# EAGLE schematic schematic (EAGLE 5.07)

## Sheet 1 of 3
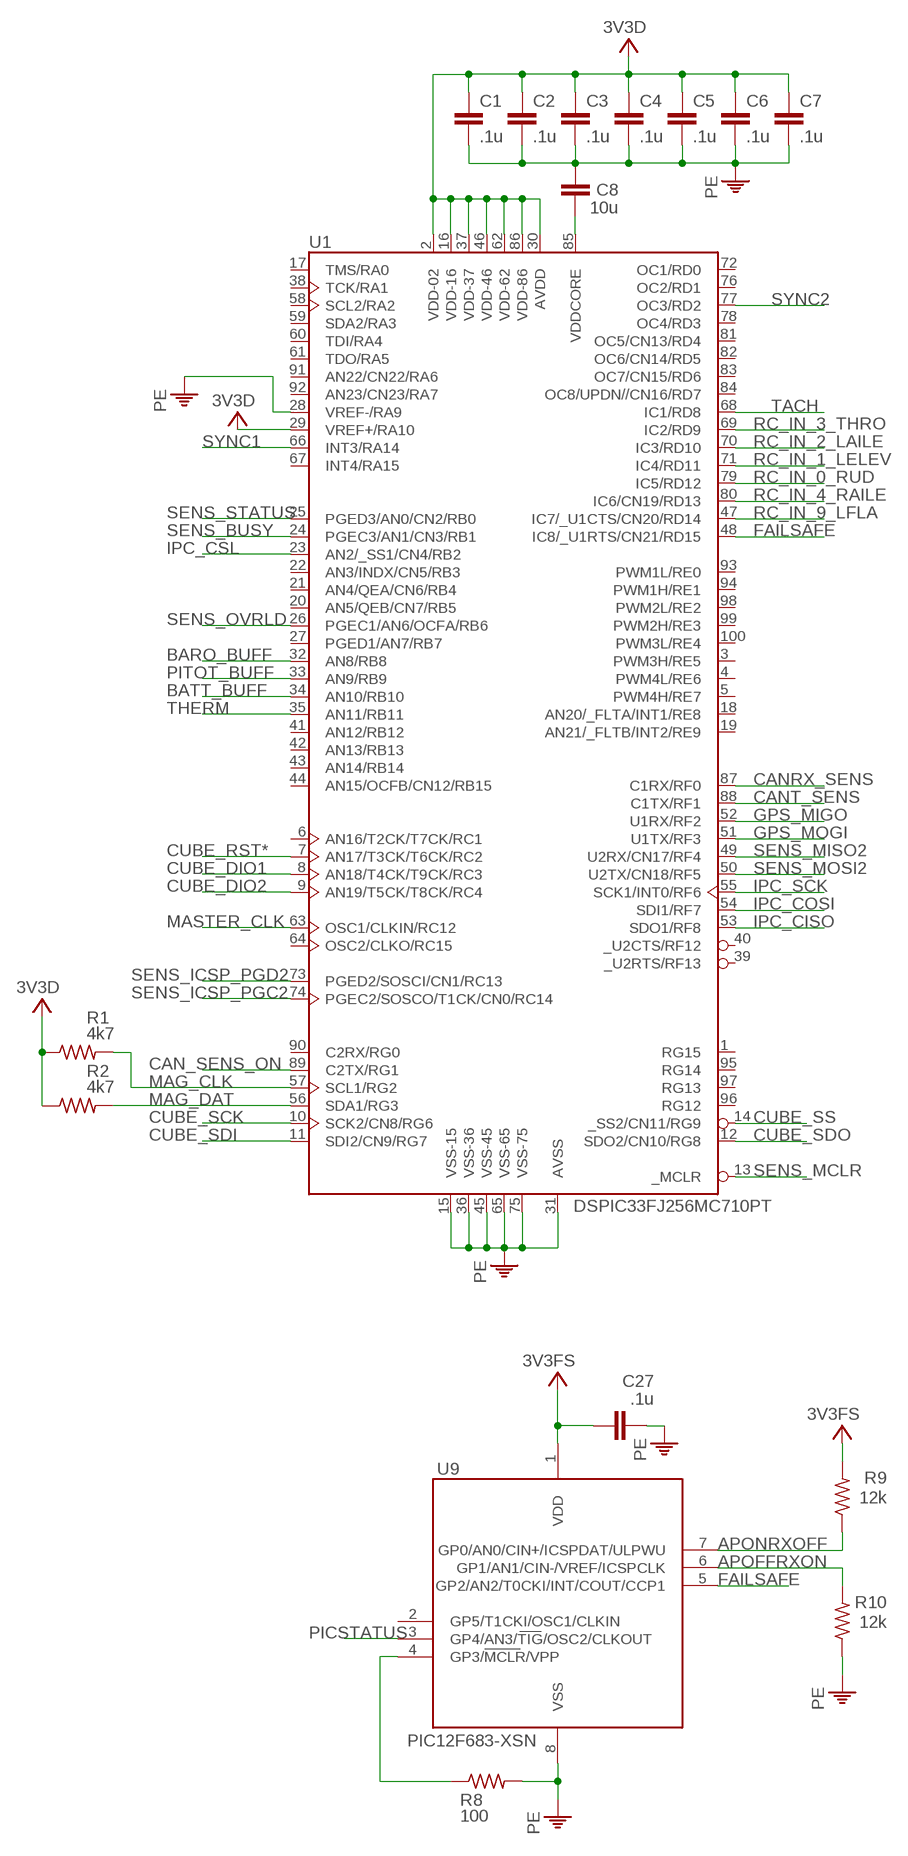
[diagram p0: schematic, sheet 1, part 1 of 2]
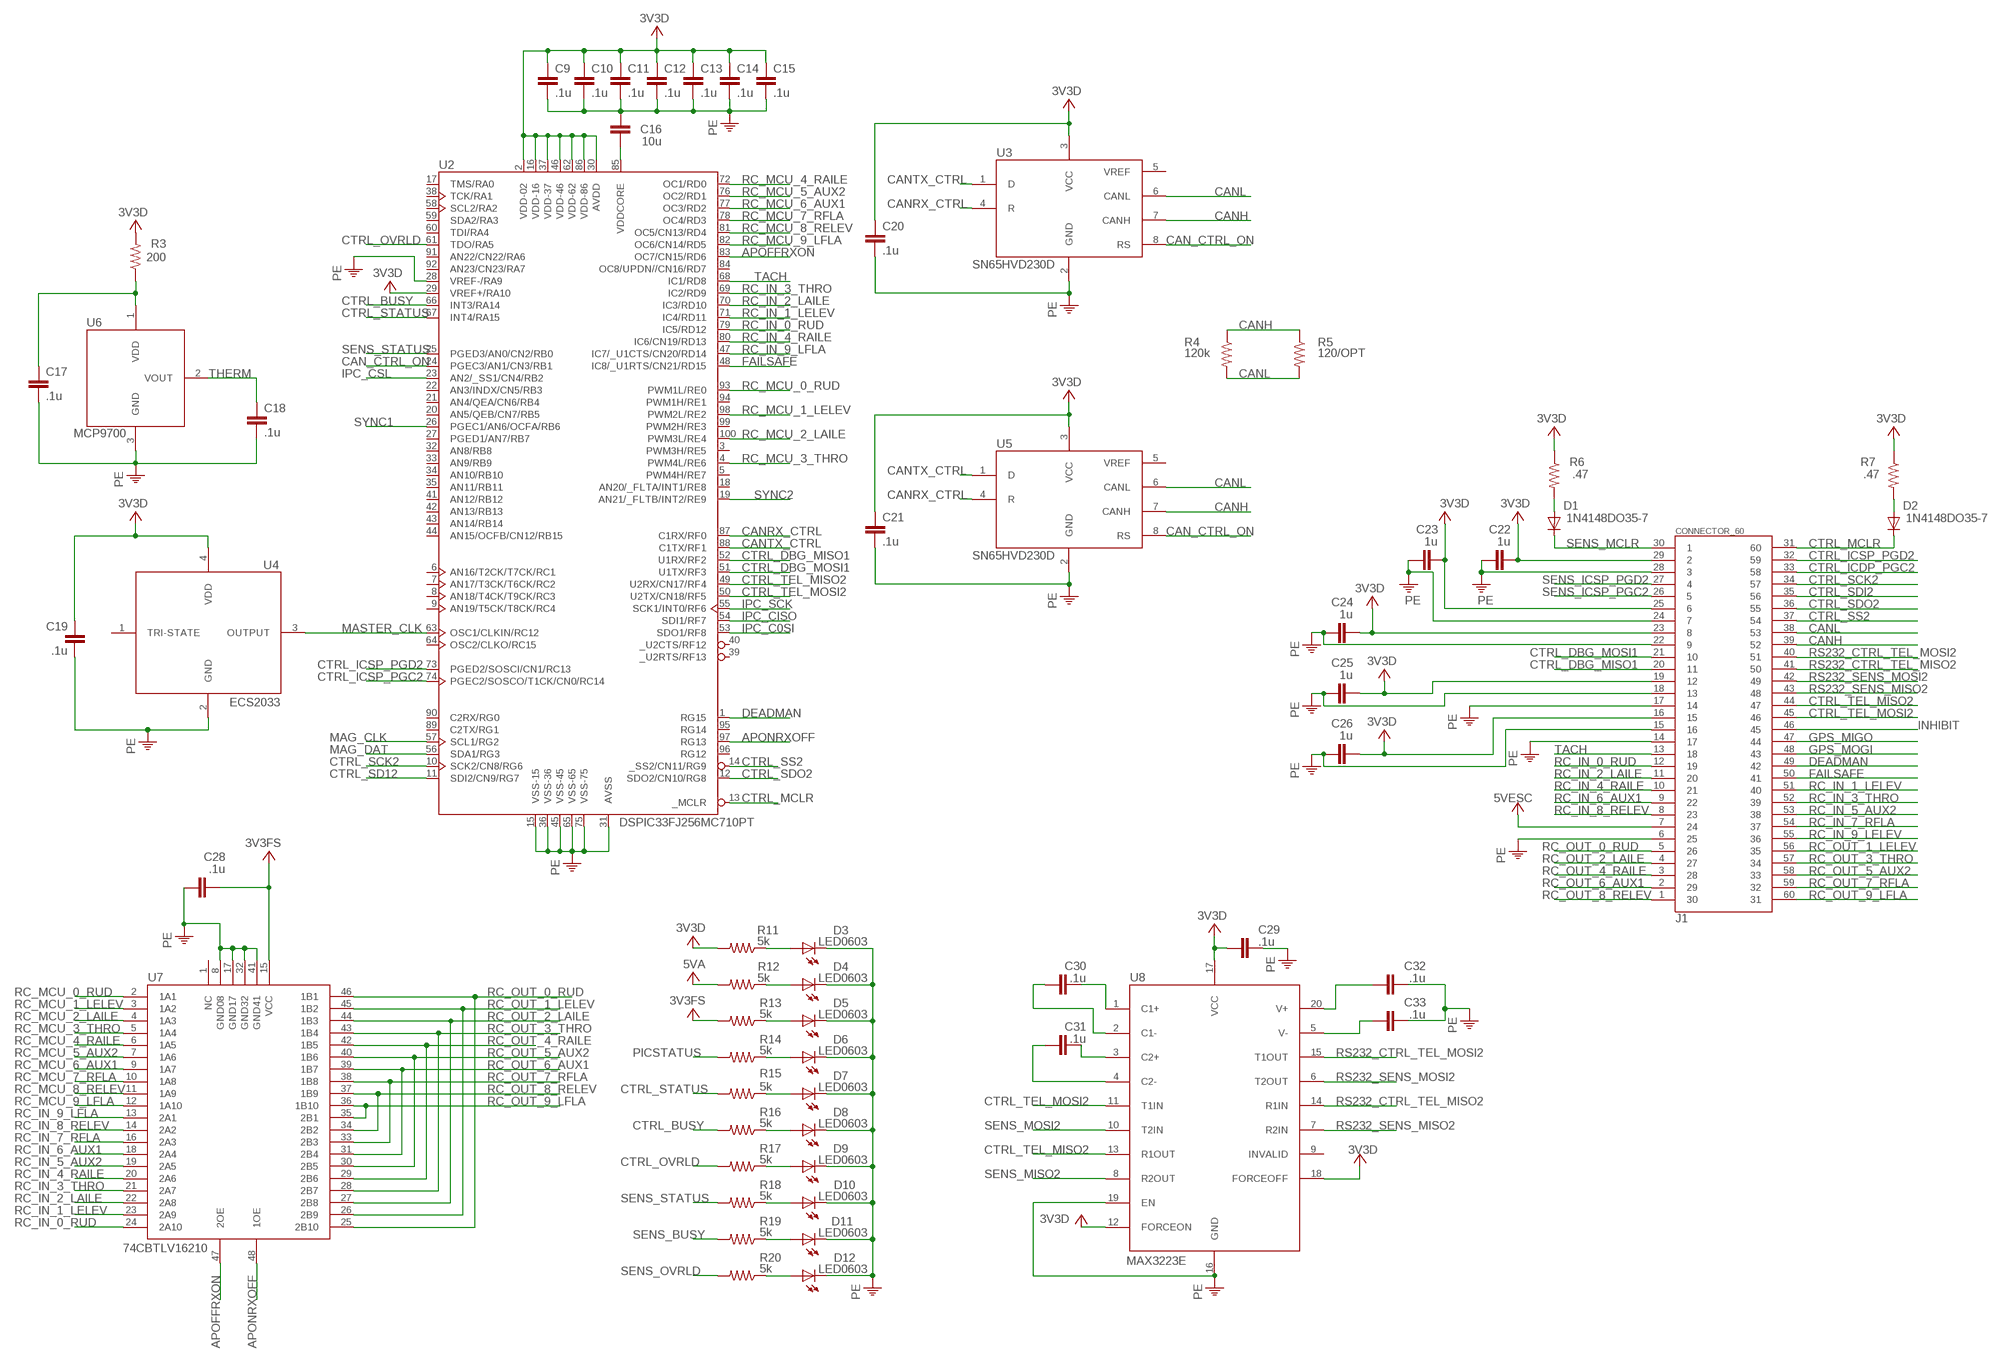
[diagram p1: schematic, sheet 1, part 2 of 2]

### Parts
C1  .1u  C-EUC0603  [C0603]
C2  .1u  C-EUC0603  [C0603]
C3  .1u  C-EUC0603  [C0603]
C4  .1u  C-EUC0603  [C0603]
C5  .1u  C-EUC0603  [C0603]
C6  .1u  C-EUC0603  [C0603]
C7  .1u  C-EUC0603  [C0603]
C8  10u  C-EUC0603  [C0603]
C9  .1u  C-EUC0603  [C0603]
C10  .1u  C-EUC0603  [C0603]
C11  .1u  C-EUC0603  [C0603]
C12  .1u  C-EUC0603  [C0603]
C13  .1u  C-EUC0603  [C0603]
C14  .1u  C-EUC0603  [C0603]
C15  .1u  C-EUC0603  [C0603]
C16  10u  C-EUC0603  [C0603]
C17  .1u  C-EUC0603  [C0603]
C18  .1u  C-EUC0603  [C0603]
C19  .1u  C-EUC0603  [C0603]
C20  .1u  C-EUC0603  [C0603]
C21  .1u  C-EUC0603  [C0603]
C22  1u  C-EUC0603  [C0603]
C23  1u  C-EUC0603  [C0603]
C24  1u  C-EUC0603  [C0603]
C25  1u  C-EUC0603  [C0603]
C26  1u  C-EUC0603  [C0603]
C27  .1u  C-EUC0603  [C0603]
C28  .1u  C-EUC0603  [C0603]
C29  .1u  C-EUC0603  [C0603]
C30  .1u  C-EUC0603  [C0603]
C31  .1u  C-EUC0603  [C0603]
C32  .1u  C-EUC0603  [C0603]
C33  .1u  C-EUC0603  [C0603]
D1  1N4148DO35-7  [DO35-7]
D2  1N4148DO35-7  [DO35-7]
D3  LED0603  LEDCHIP-LED0603  [CHIP-LED0603]
D4  LED0603  LEDCHIP-LED0603  [CHIP-LED0603]
D5  LED0603  LEDCHIP-LED0603  [CHIP-LED0603]
D6  LED0603  LEDCHIP-LED0603  [CHIP-LED0603]
D7  LED0603  LEDCHIP-LED0603  [CHIP-LED0603]
D8  LED0603  LEDCHIP-LED0603  [CHIP-LED0603]
D9  LED0603  LEDCHIP-LED0603  [CHIP-LED0603]
D10  LED0603  LEDCHIP-LED0603  [CHIP-LED0603]
D11  LED0603  LEDCHIP-LED0603  [CHIP-LED0603]
D12  LED0603  LEDCHIP-LED0603  [CHIP-LED0603]
J1  CONNECTOR_60  PRUEBA  [CONECTOR_60_TYCO_MODIFICADO]
R1  4k7  R-US_R0603  [R0603]
R2  4k7  R-US_R0603  [R0603]
R3  200  R-US_R0603  [R0603]
R4  120k  R-US_R0603  [R0603]
R5  120/OPT  R-US_R0603  [R0603]
R6  .47  R-US_R0603  [R0603]
R7  .47  R-US_R0603  [R0603]
R8  100  R-US_R0603  [R0603]
R9  12k  R-US_R0603  [R0603]
R10  12k  R-US_R0603  [R0603]
R11  5k  R-US_R0603  [R0603]
R12  5k  R-US_R0603  [R0603]
R13  5k  R-US_R0603  [R0603]
R14  5k  R-US_R0603  [R0603]
R15  5k  R-US_R0603  [R0603]
R16  5k  R-US_R0603  [R0603]
R17  5k  R-US_R0603  [R0603]
R18  5k  R-US_R0603  [R0603]
R19  5k  R-US_R0603  [R0603]
R20  5k  R-US_R0603  [R0603]
U1  DSPIC33FJ256MC710PT  [DSPIC33FJ256MC710PT]
U2  DSPIC33FJ256MC710PT  [DSPIC33FJ256MC710PT]
U3  CAN  [CAN]
U4  ECS2033  [ECS2003]
U5  CAN  [CAN]
U6  MCP9700_PATRON_RECOMENDADO  [MCP9700_PATRON_RECOMENDADO]
U7  74CBTLV16210  [74CBTLV16210]
U8  MAX3223E  [MAX3223E]
U9  PIC12F683  [PIC12F683]

### Nets
+3V3: C1.1 C7.1 C9.1 C15.1 C19.2 C20.1 C21.1 C22.2 C23.2 C24.2 C25.2 C26.2 C27.1 C28.2 C29.2 J1.16 J1.19 J1.23 J1.25 J1.29 R1.1 R2.1 R3.2 R6.1 R7.1 R9.2 R11.2 R13.2 U1.2(VDD-02) U1.16(VDD-16) U1.29(VREF+/RA10) U1.30(AVDD) U1.37(VDD-37) U1.46(VDD-46) U1.62(VDD-62) U1.86(VDD-86) U2.2(VDD-02) U2.16(VDD-16) U2.29(VREF+/RA10) U2.30(AVDD) U2.37(VDD-37) U2.46(VDD-46) U2.62(VDD-62) U2.86(VDD-86) U3.3(VCC) U4.4(VDD) U5.3(VCC) U7.15(VCC) U8.12(FORCEON) U8.17(VCC) U8.18(FORCEOFF) U9.1(VDD) ; supply symbol labelled 3V3D, 3V3FS ; also sheet 2,3
+5V: J1.7 R12.2 ; supply symbol labelled 5VA, 5VESC ; also sheet 2,3
APOFFRXON: R10.2 U2.83(OC7/CN15/RD6) U7.47(2OE) U9.6(GP1/AN1/CIN-/VREF/ICSPCLK)
APONRXOFF: R9.1 U2.97(RG13) U7.48(1OE) U9.7(GP0/AN0/CIN+/ICSPDAT/ULPWU)
BARO_BUFF: U1.32(AN8/RB8) ; also sheet 3
BATT_BUFF: U1.34(AN10/RB10) ; also sheet 3
CAN_CTRL_ON: U2.24(PGEC3/AN1/CN3/RB1) U3.8(RS) U5.8(RS)
CAN_SENS_ON: U1.89(C2TX/RG1)
CANH: J1.39 R4.1 R5.1 U3.7(CANH) U5.7(CANH)
CANL: J1.38 R4.2 R5.2 U3.6(CANL) U5.6(CANL)
CANRX_CTRL: U2.87(C1RX/RF0) U3.4(R) U5.4(R)
CANRX_SENS: U1.87(C1RX/RF0)
CANT_SENS: U1.88(C1TX/RF1)
CANTX_CTRL: U2.88(C1TX/RF1) U3.1(D) U5.1(D)
CTRL_BUSY: R16.2 U2.66(INT3/RA14)
CTRL_DBG_MISO1: J1.20 U2.52(U1RX/RF2)
CTRL_DBG_MOSI1: J1.21 U2.51(U1TX/RF3)
CTRL_ICDP_PGC2: J1.33
CTRL_ICSP_PGC2: U2.74(PGEC2/SOSCO/T1CK/CN0/RC14)
CTRL_ICSP_PGD2: J1.32 U2.73(PGED2/SOSCI/CN1/RC13)
CTRL_MCLR: D2.C J1.31 U2.13(_MCLR)
CTRL_OVRLD: R17.2 U2.61(TDO/RA5)
CTRL_SCK2: J1.34 U2.10(SCK2/CN8/RG6)
CTRL_SD12: U2.11(SDI2/CN9/RG7)
CTRL_SDI2: J1.35
CTRL_SDO2: J1.36 U2.12(SDO2/CN10/RG8)
CTRL_SS2: J1.37 U2.14(_SS2/CN11/RG9)
CTRL_STATUS: R15.2 U2.67(INT4/RA15)
CTRL_TEL_MISO2: J1.44 U2.49(U2RX/CN17/RF4) U8.13(R1OUT)
CTRL_TEL_MOSI2: J1.45 U2.50(U2TX/CN18/RF5) U8.11(T1IN)
CUBE_DIO1: U1.8(AN18/T4CK/T9CK/RC3) ; also sheet 3
CUBE_DIO2: U1.9(AN19/T5CK/T8CK/RC4) ; also sheet 3
CUBE_RST*: U1.7(AN17/T3CK/T6CK/RC2) ; also sheet 3
CUBE_SCK: U1.10(SCK2/CN8/RG6) ; also sheet 3
CUBE_SDI: U1.11(SDI2/CN9/RG7) ; also sheet 3
CUBE_SDO: U1.12(SDO2/CN10/RG8)
CUBE_SS: U1.14(_SS2/CN11/RG9) ; also sheet 3
DEADMAN: J1.49 U2.1(RG15)
FAILSAFE: J1.50 U1.48(IC8/_U1RTS/CN21/RD15) U2.48(IC8/_U1RTS/CN21/RD15) U9.5(GP2/AN2/T0CKI/INT/COUT/CCP1)
GPS_MIGO: J1.47 U1.52(U1RX/RF2)
GPS_MOGI: J1.48 U1.51(U1TX/RF3)
INHIBIT: J1.46 ; also sheet 2
IPC_C0SI: U2.53(SDO1/RF8)
IPC_CISO: U1.53(SDO1/RF8) U2.54(SDI1/RF7)
IPC_COSI: U1.54(SDI1/RF7)
IPC_CSL: U1.23(AN2/_SS1/CN4/RB2) U2.23(AN2/_SS1/CN4/RB2)
IPC_SCK: U1.55(SCK1/INT0/RF6) U2.55(SCK1/INT0/RF6)
MAG_CLK: R1.2 U1.57(SCL1/RG2) U2.57(SCL1/RG2) ; also sheet 3
MAG_DAT: R2.2 U1.56(SDA1/RG3) U2.56(SDA1/RG3) ; also sheet 3
MASTER_CLK: U1.63(OSC1/CLKIN/RC12) U2.63(OSC1/CLKIN/RC12) U4.3(OUTPUT)
N$6: U1.65(VSS-65)
N$13: U2.65(VSS-65)
N$32: C30.2 U8.1(C1+)
N$33: C5.1
N$34: D3.A R11.1
N$67: C8.1 U1.85(VDDCORE)
N$70: D4.A R12.1
N$103: U7.29(2B6)
N$104: D5.A R13.1
N$106: D6.A R14.1
N$107: D7.A R15.1
N$108: D8.A R16.1
N$109: D9.A R17.1
N$110: C10.1 C11.1 C12.1 C14.1
N$111: D10.A R18.1
N$112: D11.A R19.1
N$113: D12.A R20.1
N$114: C30.1 U8.2(C1-)
N$115: C32.1 U8.20(V+)
N$116: C31.2 U8.3(C2+)
N$117: C31.1 U8.4(C2-)
N$118: C33.1 U8.5(V-)
N$120: D1.A R6.2
N$135: D2.A R7.2
N$143: C13.1
N$146: C16.1 U2.85(VDDCORE)
N$161: R8.1 U9.4(GP3/MCLR/VPP)
N$170: C17.1 R3.1 U6.1(VDD)
N$187: C2.1 C3.1 C4.1 C6.1
PE: C1.2 C2.2 C3.2 C4.2 C5.2 C6.2 C7.2 C8.2 C9.2 C10.2 C11.2 C12.2 C13.2 C14.2 C15.2 C16.2 C17.2 C18.2 C19.1 C20.2 C21.2 C22.1 C23.1 C24.1 C25.1 C26.1 C27.2 C28.1 C29.1 C32.2 C33.2 D3.C D4.C D5.C D6.C D7.C D8.C D9.C D10.C D11.C D12.C J1.6 J1.14 J1.15 J1.17 J1.18 J1.22 J1.24 J1.28 R8.2 R10.1 U1.15(VSS-15) U1.28(VREF-/RA9) U1.31(AVSS) U1.36(VSS-36) U1.45(VSS-45) U1.75(VSS-75) U2.15(VSS-15) U2.28(VREF-/RA9) U2.31(AVSS) U2.36(VSS-36) U2.45(VSS-45) U2.75(VSS-75) U3.2(GND) U4.2(GND) U5.2(GND) U6.3(GND) U7.8(GND08) U7.17(GND17) U7.32(GND32) U7.41(GND41) U8.16(GND) U8.19(EN) U9.8(VSS) ; also sheet 2,3
PICSTATUS: R14.2 U9.3(GP4/AN3/TIG/OSC2/CLKOUT)
PITOT_BUFF: U1.33(AN9/RB9) ; also sheet 3
RC_IN_0_RUD: J1.12 U1.79(IC5/RD12) U2.79(IC5/RD12) U7.24(2A10)
RC_IN_1_LELEV: J1.51 U1.71(IC4/RD11) U2.71(IC4/RD11) U7.23(2A9)
RC_IN_2_LAILE: J1.11 U1.70(IC3/RD10) U2.70(IC3/RD10) U7.22(2A8)
RC_IN_3_THRO: J1.52 U1.69(IC2/RD9) U2.69(IC2/RD9) U7.21(2A7)
RC_IN_4_RAILE: J1.10 U1.80(IC6/CN19/RD13) U2.80(IC6/CN19/RD13) U7.20(2A6)
RC_IN_5_AUX2: J1.53 U7.19(2A5)
RC_IN_6_AUX1: J1.9 U7.18(2A4)
RC_IN_7_RFLA: J1.54 U7.16(2A3)
RC_IN_8_RELEV: J1.8 U7.14(2A2)
RC_IN_9_LELEV: J1.55
RC_IN_9_LFLA: U1.47(IC7/_U1CTS/CN20/RD14) U2.47(IC7/_U1CTS/CN20/RD14) U7.13(2A1)
RC_MCU_0_RUD: U2.93(PWM1L/RE0) U7.2(1A1)
RC_MCU_1_LELEV: U2.98(PWM2L/RE2) U7.3(1A2)
RC_MCU_2_LAILE: U2.100(PWM3L/RE4) U7.4(1A3)
RC_MCU_3_THRO: U2.4(PWM4L/RE6) U7.5(1A4)
RC_MCU_4_RAILE: U2.72(OC1/RD0) U7.6(1A5)
RC_MCU_5_AUX2: U2.76(OC2/RD1) U7.7(1A6)
RC_MCU_6_AUX1: U2.77(OC3/RD2) U7.9(1A7)
RC_MCU_7_RFLA: U2.78(OC4/RD3) U7.10(1A8)
RC_MCU_8_RELEV: U2.81(OC5/CN13/RD4) U7.11(1A9)
RC_MCU_9_LFLA: U2.82(OC6/CN14/RD5) U7.12(1A10)
RC_OUT_0_RUD: J1.5 U7.25(2B10) U7.46(1B1)
RC_OUT_1_LELEV: J1.56 U7.26(2B9) U7.45(1B2)
RC_OUT_2_LAILE: J1.4 U7.27(2B8) U7.44(1B3)
RC_OUT_3_THRO: J1.57 U7.28(2B7) U7.43(1B4)
RC_OUT_4_RAILE: J1.3 U7.42(1B5)
RC_OUT_5_AUX2: J1.58 U7.30(2B5) U7.40(1B6)
RC_OUT_6_AUX1: J1.2 U7.31(2B4) U7.39(1B7)
RC_OUT_7_RFLA: J1.59 U7.33(2B3) U7.38(1B8)
RC_OUT_8_RELEV: J1.1 U7.34(2B2) U7.37(1B9)
RC_OUT_9_LFLA: J1.60 U7.35(2B1) U7.36(1B10)
RS232_CTRL_TEL_MISO2: J1.41 U8.14(R1IN)
RS232_CTRL_TEL_MOSI2: J1.40 U8.15(T1OUT)
RS232_SENS_MISO2: J1.43 U8.7(R2IN)
RS232_SENS_MOSI2: J1.42 U8.6(T2OUT)
SENS_BUSY: R19.2 U1.24(PGEC3/AN1/CN3/RB1)
SENS_ICSP_PGC2: J1.26 U1.74(PGEC2/SOSCO/T1CK/CN0/RC14)
SENS_ICSP_PGD2: J1.27 U1.73(PGED2/SOSCI/CN1/RC13)
SENS_MCLR: D1.C J1.30 U1.13(_MCLR)
SENS_MISO2: U1.49(U2RX/CN17/RF4) U8.8(R2OUT)
SENS_MOSI2: U1.50(U2TX/CN18/RF5) U8.10(T2IN)
SENS_OVRLD: R20.2 U1.26(PGEC1/AN6/OCFA/RB6)
SENS_STATUS: R18.2 U1.25(PGED3/AN0/CN2/RB0) U2.25(PGED3/AN0/CN2/RB0)
SYNC1: U1.66(INT3/RA14) U2.26(PGEC1/AN6/OCFA/RB6)
SYNC2: U1.77(OC3/RD2) U2.19(AN21/_FLTB/INT2/RE9)
TACH: J1.13 U1.68(IC1/RD8) U2.68(IC1/RD8)
THERM: C18.1 U1.35(AN11/RB11) U6.2(VOUT)
Unconnected: U1.1(RG15) U1.3(PWM3H/RE5) U1.4(PWM4L/RE6) U1.5(PWM4H/RE7) U1.6(AN16/T2CK/T7CK/RC1) U1.17(TMS/RA0) U1.18(AN20/_FLTA/INT1/RE8) U1.19(AN21/_FLTB/INT2/RE9) U1.20(AN5/QEB/CN7/RB5) U1.21(AN4/QEA/CN6/RB4) U1.22(AN3/INDX/CN5/RB3) U1.27(PGED1/AN7/RB7) U1.38(TCK/RA1) U1.39(_U2RTS/RF13) U1.40(_U2CTS/RF12) U1.41(AN12/RB12) U1.42(AN13/RB13) U1.43(AN14/RB14) U1.44(AN15/OCFB/CN12/RB15) U1.58(SCL2/RA2) U1.59(SDA2/RA3) U1.60(TDI/RA4) U1.61(TDO/RA5) U1.64(OSC2/CLKO/RC15) U1.67(INT4/RA15) U1.72(OC1/RD0) U1.76(OC2/RD1) U1.78(OC4/RD3) U1.81(OC5/CN13/RD4) U1.82(OC6/CN14/RD5) U1.83(OC7/CN15/RD6) U1.84(OC8/UPDN//CN16/RD7) U1.90(C2RX/RG0) U1.91(AN22/CN22/RA6) U1.92(AN23/CN23/RA7) U1.93(PWM1L/RE0) U1.94(PWM1H/RE1) U1.95(RG14) U1.96(RG12) U1.97(RG13) U1.98(PWM2L/RE2) U1.99(PWM2H/RE3) U1.100(PWM3L/RE4) U2.3(PWM3H/RE5) U2.5(PWM4H/RE7) U2.6(AN16/T2CK/T7CK/RC1) U2.7(AN17/T3CK/T6CK/RC2) U2.8(AN18/T4CK/T9CK/RC3) U2.9(AN19/T5CK/T8CK/RC4) U2.17(TMS/RA0) U2.18(AN20/_FLTA/INT1/RE8) U2.20(AN5/QEB/CN7/RB5) U2.21(AN4/QEA/CN6/RB4) U2.22(AN3/INDX/CN5/RB3) U2.27(PGED1/AN7/RB7) U2.32(AN8/RB8) U2.33(AN9/RB9) U2.34(AN10/RB10) U2.35(AN11/RB11) U2.38(TCK/RA1) U2.39(_U2RTS/RF13) U2.40(_U2CTS/RF12) U2.41(AN12/RB12) U2.42(AN13/RB13) U2.43(AN14/RB14) U2.44(AN15/OCFB/CN12/RB15) U2.58(SCL2/RA2) U2.59(SDA2/RA3) U2.60(TDI/RA4) U2.64(OSC2/CLKO/RC15) U2.84(OC8/UPDN//CN16/RD7) U2.89(C2TX/RG1) U2.90(C2RX/RG0) U2.91(AN22/CN22/RA6) U2.92(AN23/CN23/RA7) U2.94(PWM1H/RE1) U2.95(RG14) U2.96(RG12) U2.99(PWM2H/RE3) U3.5(VREF) U4.1(TRI-STATE) U5.5(VREF) U7.1(NC) U8.9(INVALID) U9.2(GP5/T1CKI/OSC1/CLKIN)

## Sheet 2 of 3
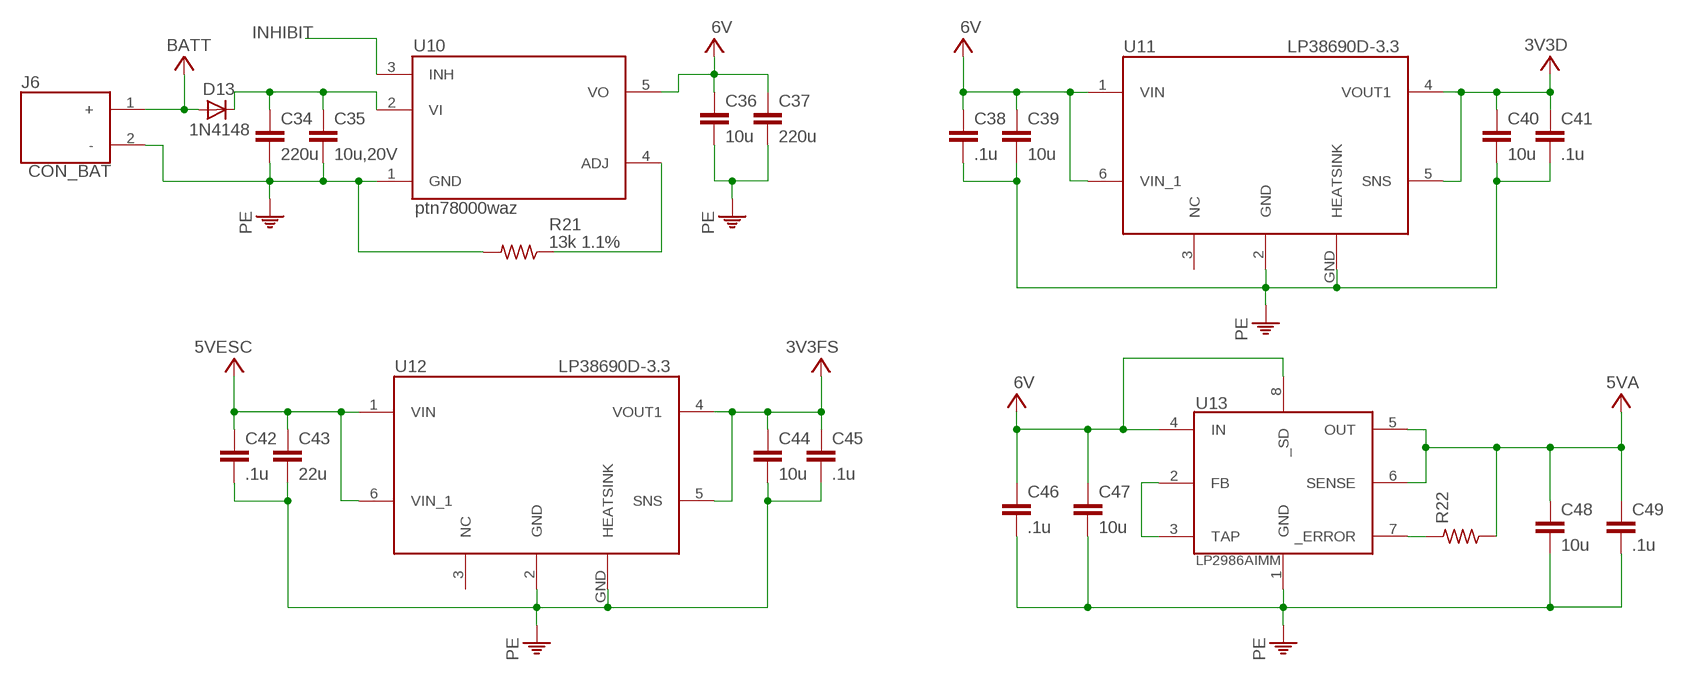
[diagram p2: schematic, sheet 2]

### Parts
C34  220u  C-EUC0603  [C0603]
C35  10u,20V  C-EUC0603  [C0603]
C36  10u  C-EUC0603  [C0603]
C37  220u  C-EUC0603  [C0603]
C38  .1u  C-EUC0603  [C0603]
C39  10u  C-EUC0603  [C0603]
C40  10u  C-EUC0603  [C0603]
C41  .1u  C-EUC0603  [C0603]
C42  .1u  C-EUC0603  [C0603]
C43  22u  C-EUC0603  [C0603]
C44  10u  C-EUC0603  [C0603]
C45  .1u  C-EUC0603  [C0603]
C46  .1u  C-EUC0603  [C0603]
C47  10u  C-EUC0603  [C0603]
C48  10u  C-EUC0603  [C0603]
C49  .1u  C-EUC0603  [C0603]
D13  1N4148  1N4148DO35-7  [DO35-7]
J6  CON_BAT  [CON_BAT]
R21  13k 1.1%  R-US_R0603  [R0603]
R22  R-US_R0603  [R0603]
U10  PTN78000W  [PTN78000W]
U11  LP38690SD-3.3  [LP38690SD-3.3]
U12  LP38690SD-3.3  [LP38690SD-3.3]
U13  LP2986AIMM-1  [M08A]

### Nets
+3V3: C40.1 C41.1 C44.1 C45.1 D13.A J6.1(+) U11.4(VOUT1) U11.5(SNS) U12.4(VOUT1) U12.5(SNS) ; supply symbol labelled BATT, 3V3D, 3V3FS ; also sheet 1,3
+5V: C36.1 C37.1 C38.1 C39.1 C42.1 C43.1 C46.1 C47.1 C48.1 C49.1 R22.1 U10.5(VO) U11.1(VIN) U11.6(VIN_1) U12.1(VIN) U12.6(VIN_1) U13.4(IN) U13.5(OUT) U13.6(SENSE) U13.8(_SD) ; supply symbol labelled 6V, 5VESC, 5VA ; also sheet 1,3
INHIBIT: U10.3(INH) ; also sheet 1
N$1: R21.1 U10.4(ADJ)
N$11: C34.1 C35.1 D13.C U10.2(VI)
N$12: U13.2(FB) U13.3(TAP)
N$16: R22.2 U13.7(_ERROR)
PE: C34.2 C35.2 C36.2 C37.2 C38.2 C39.2 C40.2 C41.2 C42.2 C43.2 C44.2 C45.2 C46.2 C47.2 C48.2 C49.2 J6.2(-) R21.2 U10.1(GND) U11.2(GND) U11.GND(HEATSINK) U12.2(GND) U12.GND(HEATSINK) U13.1(GND) ; also sheet 1,3
Unconnected: U11.3(NC) U12.3(NC)

## Sheet 3 of 3
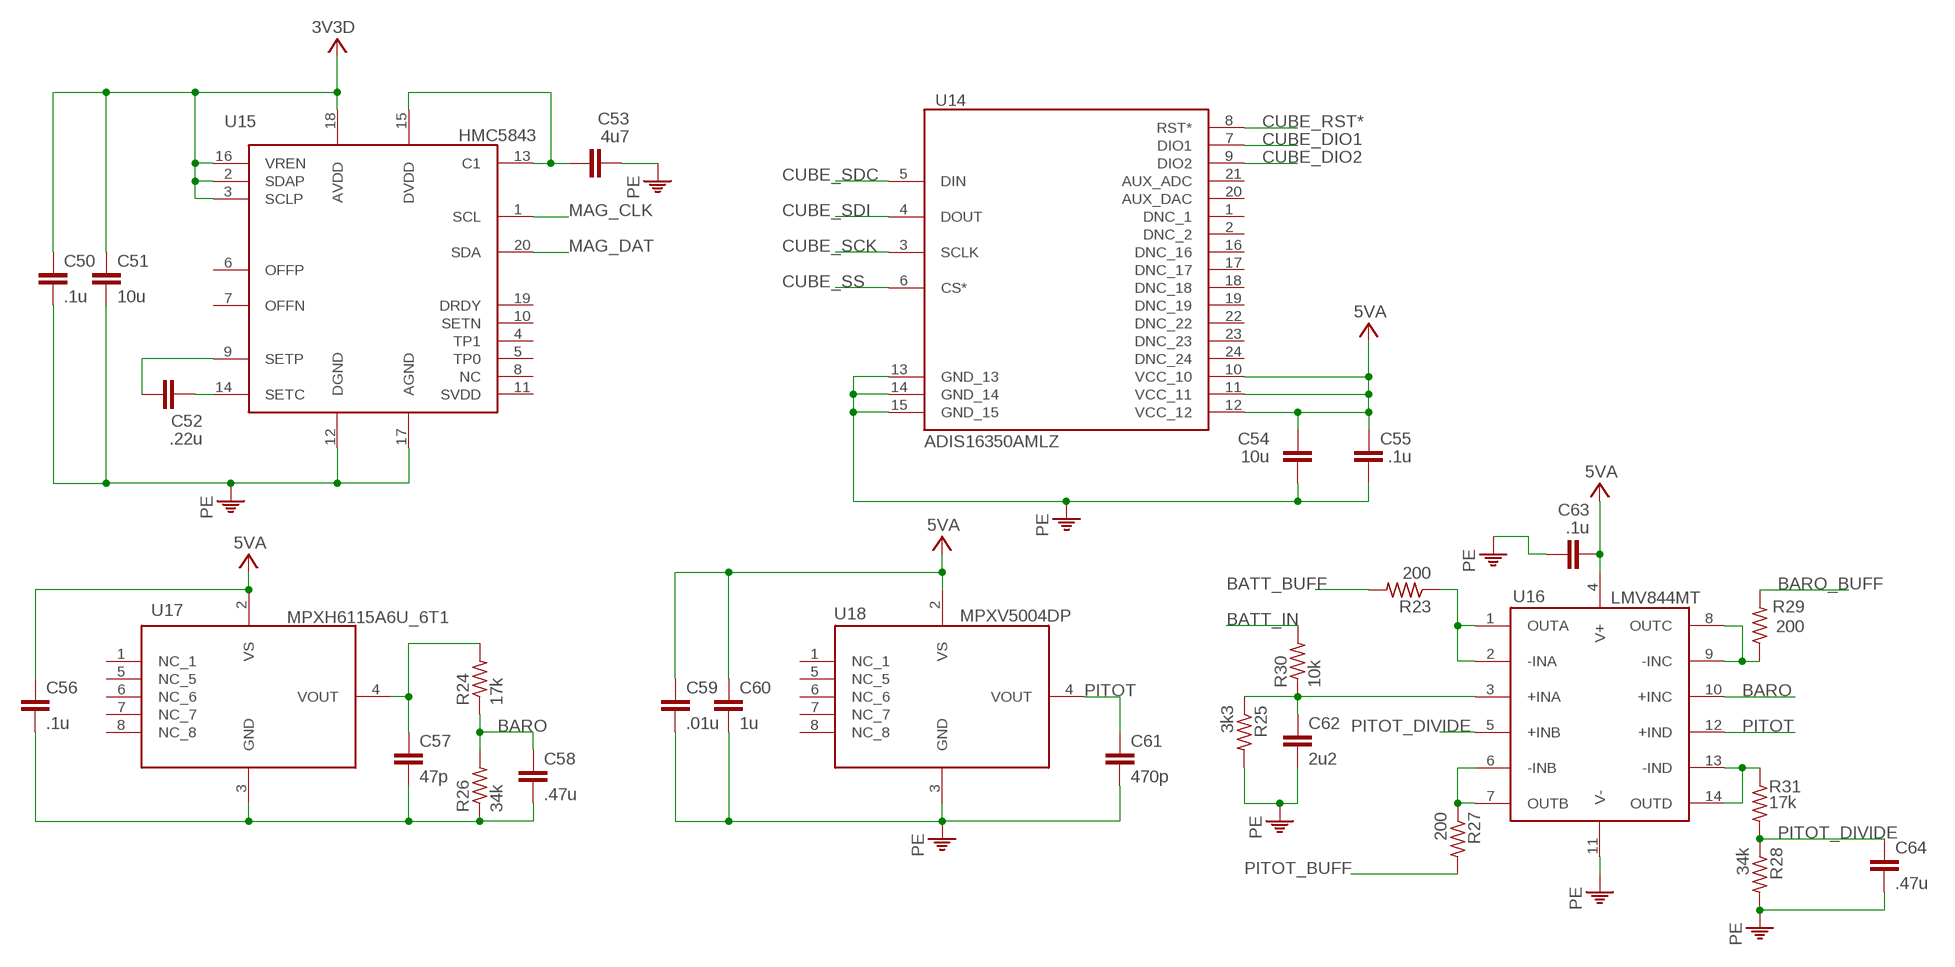
[diagram p3: schematic, sheet 3]

### Parts
C50  .1u  C-EUC0603  [C0603]
C51  10u  C-EUC0603  [C0603]
C52  .22u  C-EUC0603  [C0603]
C53  4u7  C-EUC0603  [C0603]
C54  10u  C-EUC0603  [C0603]
C55  .1u  C-EUC0603  [C0603]
C56  .1u  C-EUC0603  [C0603]
C57  47p  C-EUC0603  [C0603]
C58  .47u  C-EUC0603  [C0603]
C59  .01u  C-EUC0603  [C0603]
C60  1u  C-EUC0603  [C0603]
C61  470p  C-EUC0603  [C0603]
C62  2u2  C-EUC0603  [C0603]
C63  .1u  C-EUC0603  [C0603]
C64  .47u  C-EUC0603  [C0603]
R23  200  R-US_R0603  [R0603]
R24  17k  R-US_R0603  [R0603]
R25  3k3  R-US_R0603  [R0603]
R26  34k  R-US_R0603  [R0603]
R27  200  R-US_R0603  [R0603]
R28  34k  R-US_R0603  [R0603]
R29  200  R-US_R0603  [R0603]
R30  10k  R-US_R0603  [R0603]
R31  17k  R-US_R0603  [R0603]
U14  ADIS16355AMLZ  [ADIS16355AMLZ]
U15  HMC5843  [HMC5843]
U16  LMV844MT  [MTC14]
U17  MPXH6115A6U_6T1  [1317A-03]
U18  MPXV5004DP  [1351-01]

### Nets
+3V3: C50.1 C51.1 U15.2(SDAP) U15.3(SCLP) U15.16(VREN) U15.18(AVDD) ; supply symbol labelled 3V3D ; also sheet 1,2
+5V: C54.2 C55.2 C56.1 C59.1 C60.1 C63.2 U14.10(VCC_10) U14.11(VCC_11) U14.12(VCC_12) U16.4(V+) U17.2(VS) U18.2(VS) ; supply symbol labelled 5VA ; also sheet 1,2
BARO: C58.1 R24.1 R26.2 U16.10(+INC)
BARO_BUFF: R29.2 ; also sheet 1
BATT_BUFF: R23.2 ; also sheet 1
BATT_IN: R30.2
CUBE_DIO1: U14.7(DIO1) ; also sheet 1
CUBE_DIO2: U14.9(DIO2) ; also sheet 1
CUBE_RST*: U14.8(RST*) ; also sheet 1
CUBE_SCK: U14.3(SCLK) ; also sheet 1
CUBE_SDC: U14.5(DIN)
CUBE_SDI: U14.4(DOUT) ; also sheet 1
CUBE_SS: U14.6(CS*) ; also sheet 1
MAG_CLK: U15.1(SCL) ; also sheet 1
MAG_DAT: U15.20(SDA) ; also sheet 1
N$2: C53.1 U15.13(C1) U15.15(DVDD)
N$3: C56.2 C57.2 C58.2 R26.1 U17.3(GND)
N$4: C57.1 R24.2 U17.4(VOUT)
N$5: R23.1 U16.1(OUTA) U16.2(-INA)
N$7: C62.1 R25.1 R30.1 U16.3(+INA)
N$8: C52.1 U15.9(SETP)
N$9: C52.2 U15.14(SETC)
N$10: R27.1 U16.6(-INB) U16.7(OUTB)
N$14: R29.1 U16.8(OUTC) U16.9(-INC)
N$15: R31.1 U16.13(-IND) U16.14(OUTD)
PE: C50.2 C51.2 C53.2 C54.1 C55.1 C59.2 C60.2 C61.2 C62.2 C63.1 C64.2 R25.2 R28.2 U14.13(GND_13) U14.14(GND_14) U14.15(GND_15) U15.12(DGND) U15.17(AGND) U16.11(V-) U18.3(GND) ; also sheet 1,2
PITOT: C61.1 U16.12(+IND) U18.4(VOUT)
PITOT_BUFF: R27.2 ; also sheet 1
PITOT_DIVIDE: C64.1 R28.1 R31.2 U16.5(+INB)
Unconnected: U14.1(DNC_1) U14.2(DNC_2) U14.16(DNC_16) U14.17(DNC_17) U14.18(DNC_18) U14.19(DNC_19) U14.20(AUX_DAC) U14.21(AUX_ADC) U14.22(DNC_22) U14.23(DNC_23) U14.24(DNC_24) U15.4(TP1) U15.5(TP0) U15.6(OFFP) U15.7(OFFN) U15.8(NC) U15.10(SETN) U15.11(SVDD) U15.19(DRDY) U17.1(NC_1) U17.5(NC_5) U17.6(NC_6) U17.7(NC_7) U17.8(NC_8) U18.1(NC_1) U18.5(NC_5) U18.6(NC_6) U18.7(NC_7) U18.8(NC_8)

## Library data of the parts
C1-C64 = rcl:C-EU: CAPACITOR, European symbol
D1 D2 D13 = diode:1N4148: DIODE high speed (Philips)
D3-D12 = led:LED: LED OSRAM: - CHIPLED LG R971, LG N971, LY N971, LG Q971, LY Q971, LO R971, LY R971 LH N974, LH R974 LS Q976, LO Q976, LY Q976 LO Q996 - Hyper CHIPLED LW Q18S LB Q993, LB Q99A, LB R99A - SideLED LS A670, LO A670, LY A670, LG A670, LP A670 LB A673, LV A673, LT A673, LW A673 LH A674 LY A675 LS A676, LA A676, LO A676, LY A676, LW A676 LS A679, LY A679, LG A679 - Hyper Micro SIDELED® LS Y876, LA Y876, LO Y876, LY Y876 LT Y87S - SmartLED LW L88C, LW L88S LB L89C, LB L89S, LG L890 LS L89K, LO L89K, LY L89K LS L896, LA L896, LO L896, LY L896 - TOPLED LS T670, LO T670, LY T670, LG T670, LP T670 LSG T670, LSP T670, LSY T670, LOP T670, LYG T670 LG T671, LOG T671, LSG T671 LB T673, LV T673, LT T673, LW T673 LH T674 LS T676, LA T676, LO T676, LY T676, LB T676, LH T676, LSB T676, LW T676 LB T67C, LV T67C, LT T67C, LS T67K, LO T67K, LY T67K, LW E67C LS E67B, LA E67B, LO E67B, LY E67B, LB E67C, LV E67C, LT E67C LW T67C LS T679, LY T679, LG T679 LS T770, LO T770, LY T770, LG T770, LP T770 LB T773, LV T773, LT T773, LW T773 LH T774 LS E675, LA E675, LY E675, LS T675 LS T776, LA T776, LO T776, LY T776, LB T776 LHGB T686 LT T68C, LB T68C - Hyper Mini TOPLED® LB M676 - Mini TOPLED Santana® LG M470 LS M47K, LO M47K, LY M47K Source: http://www.osram.convergy.de LUXEON: - LUMILED® LXK2-PW12-R00, LXK2-PW12-S00, LXK2-PW14-U00, LXK2-PW14-V00 LXK2-PM12-R00, LXK2-PM12-S00, LXK2-PM14-U00 LXK2-PE12-Q00, LXK2-PE12-R00, LXK2-PE12-S00, LXK2-PE14-T00, LXK2-PE14-U00 LXK2-PB12-K00, LXK2-PB12-L00, LXK2-PB12-M00, LXK2-PB14-N00, LXK2-PB14-P00, LXK2-PB14-Q00 LXK2-PR12-L00, LXK2-PR12-M00, LXK2-PR14-Q00, LXK2-PR14-R00 LXK2-PD12-Q00, LXK2-PD12-R00, LXK2-PD12-S00 LXK2-PH12-R00, LXK2-PH12-S00 LXK2-PL12-P00, LXK2-PL12-Q00, LXK2-PL12-R00 Source: www.luxeon.com KINGBRIGHT: KA-3528ASYC Source: www.kingbright.com
J1 = conector:PRUEBA
J6 = Conector bateria:CON_BAT
R1-R31 = rcl:R-US_: RESISTOR, American symbol
U1 U2 = DSPIC33FJ256MC710PT:DSPIC33FJ256MC710PT
U3 U5 = CAN:CAN
U4 = ECS2033:ECS2033
U6 = MCP9700 3 PINES patron recomendado:MCP9700_PATRON_RECOMENDADO
U7 = 74CBTLV16210_DL:74CBTLV16210
U8 = MAX3223E:MAX3223E
U9 = PIC 12F683:PIC12F683
U10 = PTN78000:PTN78000W
U11 U12 = LP38690SD-3.3:LP38690SD-3.3
U13 = LP2986AIMM:LP2986AIMM-1
U14 = ADIS16355AMLZ:ADIS16355AMLZ
U15 = HMC5843:HMC5843
U16 = LMV844MT:LMV844MT
U17 = MPXH6115A6U_6T1:MPXH6115A6U_6T1
U18 = MPXV5004DP:MPXV5004DP